# EAGLE design tangnano9k-bob-adapter2 (EAGLE 9.0.1)
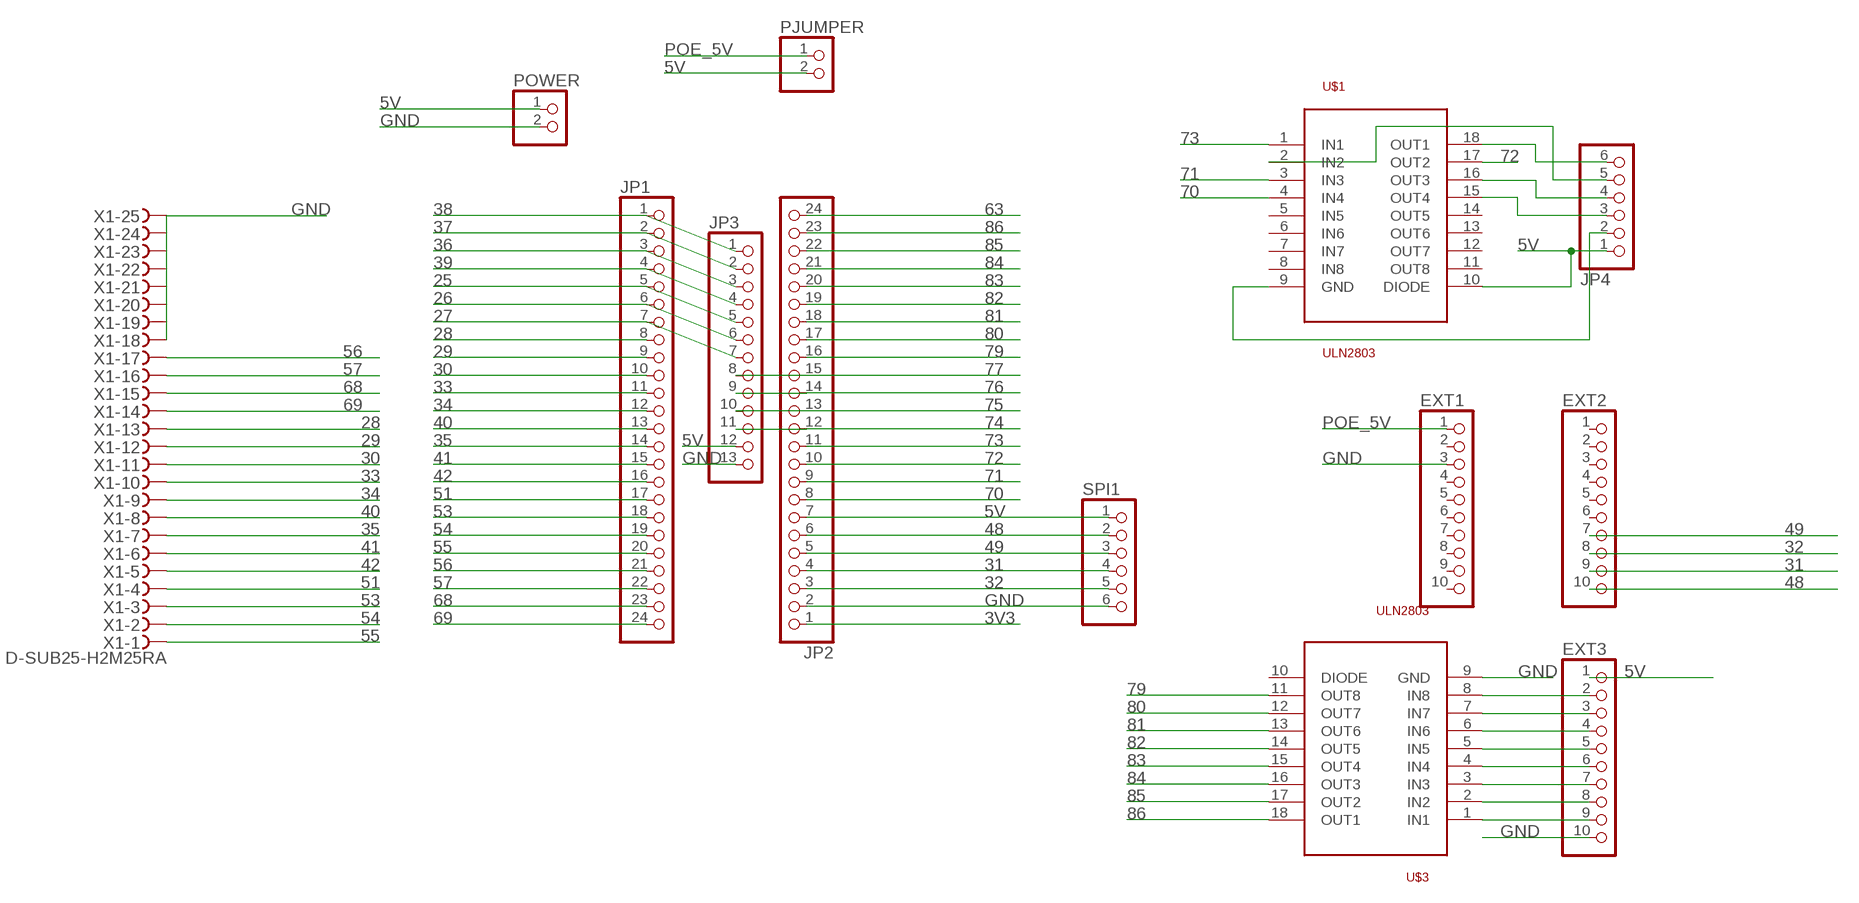
[diagram p0: schematic, sheet 1]

## Parts
EXT1  PINHD-1X10  [1X10]
EXT2  PINHD-1X10  [1X10]
EXT3  PINHD-1X10  [1X10]
JP1  PINHD-1X24  [1X24]
JP2  PINHD-1X24  [1X24]
JP3  PINHD-1X13  [1X13]
JP4  PINHD-1X6/90  [1X06/90]
PJUMPER  PINHD-1X2  [1X02]
POWER  PINHD-1X2  [1X02]
SPI1  PINHD-1X6  [1X06]
U$1  ULN2803  [SO18L]
U$3  ULN2803  [SO18L]
X1  D-SUB25-H2M25RA  [H2M25RA]

## Nets
3V3: JP2.1
5V: EXT3.1 JP2.7 JP3.12 JP4.1 PJUMPER.2 POWER.1 SPI1.1 U$1.10(DIODE)
25: JP1.5 JP3.5
26: JP1.6 JP3.6
27: JP1.7 JP3.7
28: JP1.8 X1.13
29: JP1.9 X1.12
30: JP1.10 X1.11
31: EXT2.9 JP2.4 SPI1.4
32: EXT2.8 JP2.3 SPI1.5
33: JP1.11 X1.10
34: JP1.12 X1.9
35: JP1.14 X1.7
36: JP1.3 JP3.3
37: JP1.2 JP3.2
38: JP1.1 JP3.1
39: JP1.4 JP3.4
40: JP1.13 X1.8
41: JP1.15 X1.6
42: JP1.16 X1.5
48: EXT2.10 JP2.6 SPI1.2
49: EXT2.7 JP2.5 SPI1.3
51: JP1.17 X1.4
53: JP1.18 X1.3
54: JP1.19 X1.2
55: JP1.20 X1.1
56: JP1.21 X1.17
57: JP1.22 X1.16
63: JP2.24
68: JP1.23 X1.15
69: JP1.24 X1.14
70: JP2.8 U$1.4(IN4)
71: JP2.9 U$1.3(IN3)
72: JP2.10 U$1.17(OUT2)
73: JP2.11 U$1.1(IN1)
74: JP2.12 JP3.11
75: JP2.13 JP3.10
76: JP2.14 JP3.9
77: JP2.15 JP3.8
79: JP2.16 U$3.11(OUT8)
80: JP2.17 U$3.12(OUT7)
81: JP2.18 U$3.13(OUT6)
82: JP2.19 U$3.14(OUT5)
83: JP2.20 U$3.15(OUT4)
84: JP2.21 U$3.16(OUT3)
85: JP2.22 U$3.17(OUT2)
86: JP2.23 U$3.18(OUT1)
GND: EXT1.3 EXT3.10 JP2.2 JP3.13 JP4.2 POWER.2 SPI1.6 U$1.9(GND) U$3.9(GND) X1.18 X1.19 X1.20 X1.21 X1.22 X1.23 X1.24 X1.25
N$1: EXT3.9 U$3.1(IN1)
N$2: JP4.6 U$1.18(OUT1)
N$3: JP4.5 U$1.2(IN2)
N$4: JP4.4 U$1.16(OUT3)
N$5: JP4.3 U$1.15(OUT4)
N$6: EXT3.8 U$3.2(IN2)
N$7: EXT3.7 U$3.3(IN3)
N$8: EXT3.6 U$3.4(IN4)
N$9: EXT3.5 U$3.5(IN5)
N$10: EXT3.4 U$3.6(IN6)
N$11: EXT3.3 U$3.7(IN7)
N$12: EXT3.2 U$3.8(IN8)
POE_5V: EXT1.1 PJUMPER.1
Unconnected: EXT1.2 EXT1.4 EXT1.5 EXT1.6 EXT1.7 EXT1.8 EXT1.9 EXT1.10 EXT2.1 EXT2.2 EXT2.3 EXT2.4 EXT2.5 EXT2.6 U$1.5(IN5) U$1.6(IN6) U$1.7(IN7) U$1.8(IN8) U$1.11(OUT8) U$1.12(OUT7) U$1.13(OUT6) U$1.14(OUT5) U$3.10(DIODE)

## Library data of the parts
EXT1-EXT3 = pinhead:PINHD-1X10: PIN HEADER
JP1 JP2 = pinhead:PINHD-1X24: PIN HEADER
JP3 = pinhead:PINHD-1X13: PIN HEADER
JP4 SPI1 = pinhead:PINHD-1X6: PIN HEADER
PJUMPER POWER = pinhead:PINHD-1X2: PIN HEADER
U$1 U$3 = uln2803:ULN2803
X1 = con-thomas-betts:D-SUB25-: D-Subminiatur Connector Source: Electronioc Interconnects European Edition 1998; OC_FARNELL: unknown; OC_NEWARK: unknown

## Board
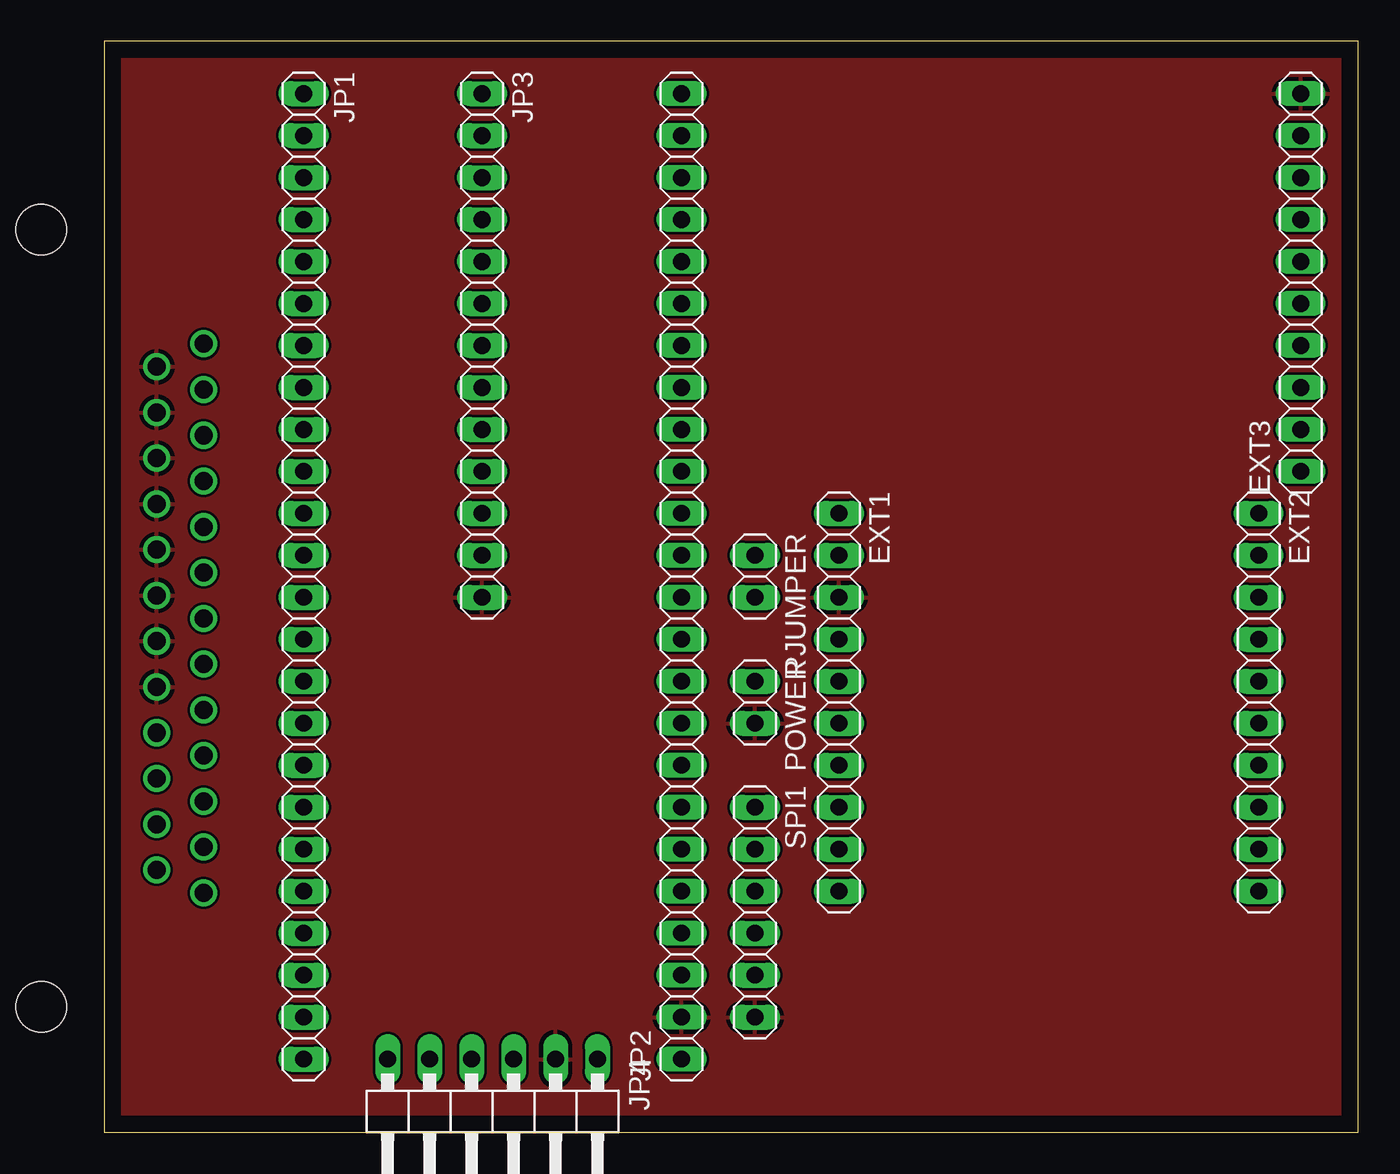
[diagram p1: board, top side]
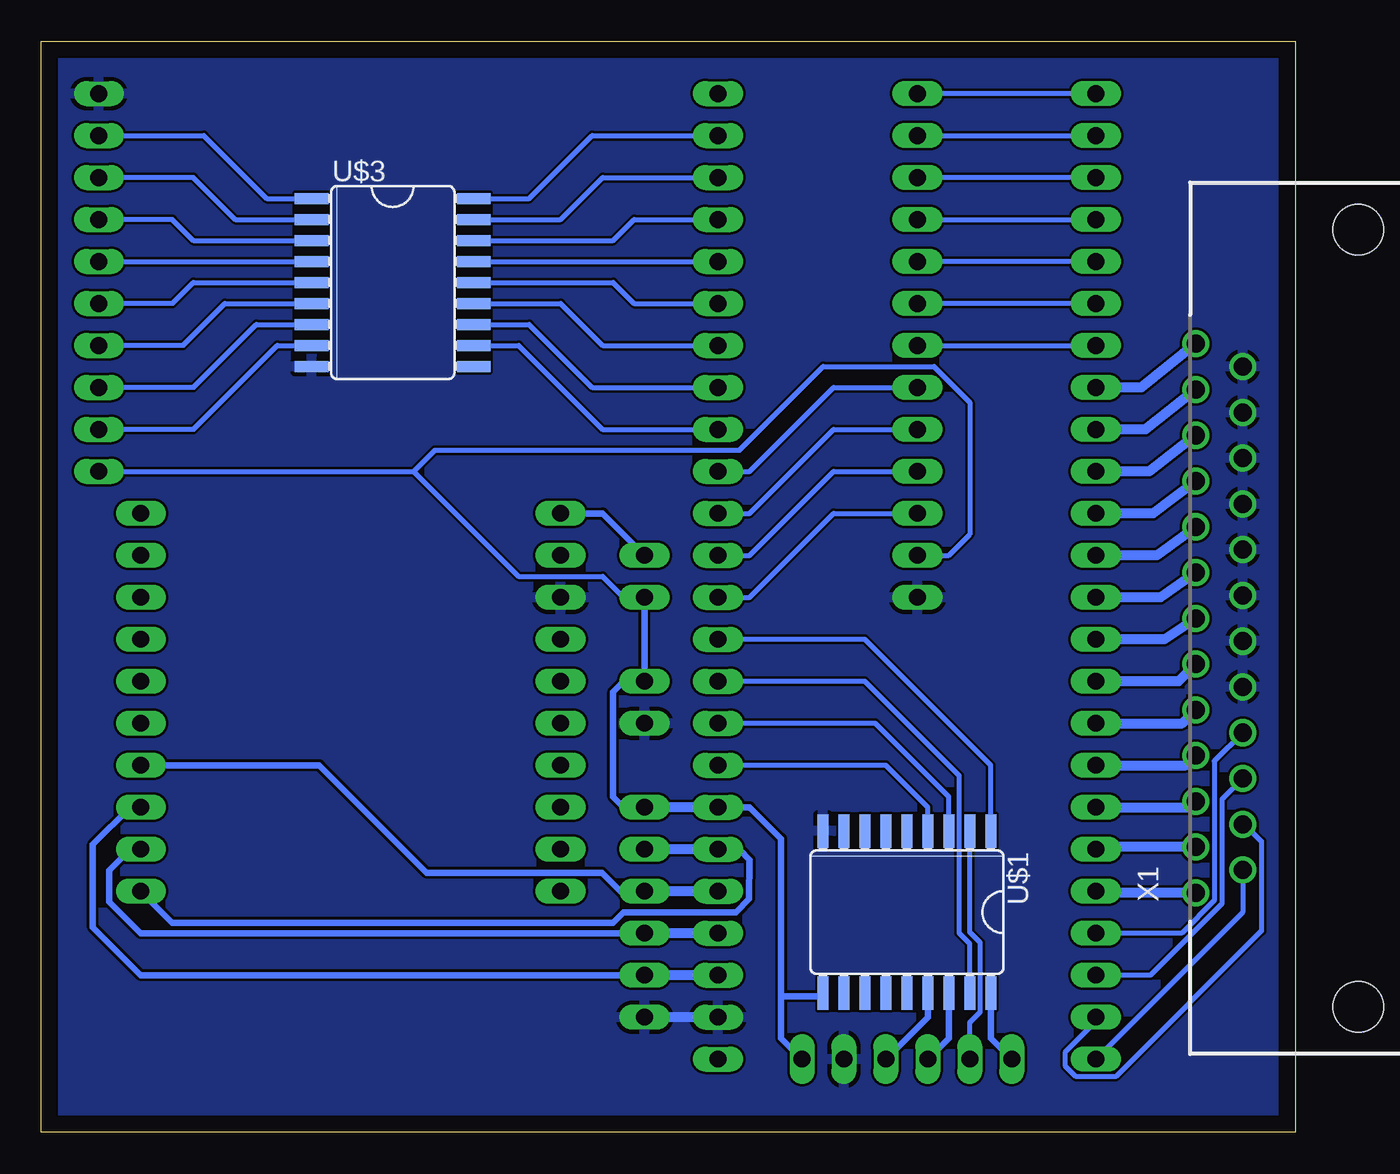
[diagram p2: board, bottom side, seen from below]

Size 75.87 x 66.03 mm. Coordinates in mm from the lower left corner, seen from the top.
Outline: 0,0 75.87,0 75.87,66.03 0,66.03 0,0
Copper layers (1*16): Top 0.035mm / dielectric 1.5mm / Bottom 0.035mm
Design rules "default": minimum track width 6mil, minimum drill 0.35mm, track to track 6mil, track to pad 6mil, pad to pad 6mil, via to via 6mil, smd to smd 6mil, copper to edge 40mil, drill to drill 6mil, minimum pad ring 10mil, minimum via ring 8mil, stop-mask expansion 4mil, vias tented up to drill 0mil, thermal gap 10mil

### Footprints (pad centres in the part's own frame; a part is rotated, then mirrored left to right if it is on the bottom)
1X10 = drill 1.016 long: 1 -11.43,0; 2 -8.89,0; 3 -6.35,0; 4 -3.81,0; 5 -1.27,0; 6 1.27,0; 7 3.81,0; 8 6.35,0; 9 8.89,0; 10 11.43,0
1X24 = drill 1.016 long: 1 -29.21,0; 2 -26.67,0; 3 -24.13,0; 4 -21.59,0; 5 -19.05,0; 6 -16.51,0; 7 -13.97,0; 8 -11.43,0; 9 -8.89,0; 10 -6.35,0; 11 -3.81,0; 12 -1.27,0; 13 1.27,0; 14 3.81,0; 15 6.35,0; 16 8.89,0; 17 11.43,0; 18 13.97,0; 19 16.51,0; 20 19.05,0; 21 21.59,0; 22 24.13,0; 23 26.67,0; 24 29.21,0
1X13 = drill 1.016 long: 1 -15.24,0; 2 -12.7,0; 3 -10.16,0; 4 -7.62,0; 5 -5.08,0; 6 -2.54,0; 7 0,0; 8 2.54,0; 9 5.08,0; 10 7.62,0; 11 10.16,0; 12 12.7,0; 13 15.24,0
1X06/90 = drill 1.016 long: 1 -6.35,-3.81; 2 -3.81,-3.81; 3 -1.27,-3.81; 4 1.27,-3.81; 5 3.81,-3.81; 6 6.35,-3.81
1X02 = drill 1.016 long: 1 -1.27,0; 2 1.27,0
1X06 = drill 1.016 long: 1 -6.35,0; 2 -3.81,0; 3 -1.27,0; 4 1.27,0; 5 3.81,0; 6 6.35,0
SO18L = smd 0.66 x 2.032: 1 -5.08,-4.902; 2 -3.81,-4.902; 3 -2.54,-4.902; 4 -1.27,-4.902; 5 0,-4.902; 6 1.27,-4.902; 7 2.54,-4.902; 8 3.81,-4.902; 9 5.08,-4.902; 10 5.08,4.902; 11 3.81,4.902; 12 2.54,4.902; 13 1.27,4.902; 14 0,4.902; 15 -1.27,4.902; 16 -2.54,4.902; 17 -3.81,4.902; 18 -5.08,4.902
H2M25RA = drill 1.092: 1 -16.612,7.925; 2 -13.843,7.925; 3 -11.074,7.925; 4 -8.306,7.925; 5 -5.537,7.925; 6 -2.769,7.925; 7 0,7.925; 8 2.769,7.925; 9 5.537,7.925; 10 8.306,7.925; 11 11.074,7.925; 12 13.843,7.925; 13 16.612,7.925; 14 -15.227,5.08; 15 -12.459,5.08; 16 -9.69,5.08; 17 -6.921,5.08; 18 -4.153,5.08; 19 -1.384,5.08; 20 1.384,5.08; 21 4.153,5.08; 22 6.921,5.08; 23 9.69,5.08; 24 12.459,5.08; 25 15.227,5.08 | hole 3.048: -23.52,-1.905; 23.52,-1.905

### Placement (x,y rotation side)
EXT1  44.45,26.04 270 top
EXT2  69.85,26.04 270 top
EXT3  72.39,51.44 90 top
JP1  12.06,33.66 270 top
JP2  34.92,33.66 90 top
JP3  22.86,47.62 270 top
JP4  23.49,0.64 180 top
PJUMPER  39.37,33.66 270 top
POWER  39.37,26.04 270 top
SPI1  39.37,13.33 270 top
U$1  23.49,13.33 180 bottom
U$3  54.61,51.44 270 bottom
X1  -1.91,31.12 90 bottom

### Tracks (layer width: path | path; a pad name or v marks a point on that pad's centre or on a via)
5V
  Bottom 0.305: PJUMPER.2 40.64,32.38 41.91,33.66 46.99,33.66 53.34,40.01 | EXT3.1 53.34,40.01 | JP3.12 20.95,34.93 19.69,36.2 19.69,44.18 21.86,46.36 28.57,46.36 33.65,41.27 52.07,41.27 53.34,40.01
  Bottom 0.406: SPI1.1 40.64,19.69 41.27,20.32 41.27,26.67 40.64,27.3 POWER.1 PJUMPER.2 | 31.11,8.25 31.11,17.78 33.02,19.69 JP2.7 | 31.11,8.25 31.11,5.71 JP4.1 | U$1.10 28.75,8.25 31.11,8.25
  Bottom 0.61: JP2.7 SPI1.1
25
  Bottom 0.305: JP1.5 JP3.5
26
  Bottom 0.305: JP1.6 JP3.6
27
  Bottom 0.305: JP3.7 JP1.7
28
  Bottom 0.61: X1.13 9.3,45.09 JP1.8
29
  Bottom 0.61: X1.12 9.07,42.55 JP1.9
30
  Bottom 0.61: X1.11 8.84,40.01 JP1.10
31
  Bottom 0.406: SPI1.4 69.85,12.06 71.76,13.97 71.76,15.88 70.48,17.14 EXT2.9
  Bottom 0.61: JP2.4 SPI1.4
32
  Bottom 0.406: SPI1.5 69.85,9.53 72.75,12.42 72.75,17.42 70.48,19.69 EXT2.8
  Bottom 0.61: JP2.3 SPI1.5
33
  Bottom 0.61: X1.10 8.61,37.47 JP1.11
34
  Bottom 0.61: X1.9 8.38,34.93 JP1.12
35
  Bottom 0.61: X1.7 7.92,29.85 JP1.14
36
  Bottom 0.305: JP1.3 JP3.3
37
  Bottom 0.305: JP3.2 JP1.2
38
  Bottom 0.305: JP1.1 JP3.1
39
  Bottom 0.305: JP3.4 JP1.4
40
  Bottom 0.61: X1.8 8.15,32.38 JP1.13
41
  Bottom 0.61: X1.6 7.06,27.3 JP1.15
42
  Bottom 0.61: JP1.16 6.83,24.77 X1.5
48
  Bottom 0.406: JP2.6 34.29,17.14 34.31,17.12 33.63,17.12 33.02,16.51 33.04,14.14 33.85,13.33 40.64,13.33 41.27,12.7 67.95,12.7 EXT2.10
  Bottom 0.61: JP2.6 SPI1.2
49
  Bottom 0.406: SPI1.3 40.84,14.6 41.95,15.72 52.55,15.72 59.05,22.23 EXT2.7
  Bottom 0.61: JP2.5 SPI1.3
51
  Bottom 0.61: JP1.17 6.6,22.23 X1.4
53
  Bottom 0.61: JP1.18 6.38,19.69 X1.3
54
  Bottom 0.61: X1.2 10.67,17.27 JP1.19
55
  Bottom 0.61: X1.1 10.69,14.5 JP1.20
56
  Bottom 0.305: X1.17 4.9,22.47 4.9,14.04 6.87,12.06 JP1.21
57
  Bottom 0.305: X1.16 4.44,20.16 4.44,13.85 8.76,9.53 JP1.22
68
  Bottom 0.305: X1.15 3.17,18.75 2.05,17.62 2.05,12.19 10.86,3.38 13.27,3.38 13.89,4 13.89,4.89 12.06,6.72 JP1.23
69
  Bottom 0.305: X1.14 3.17,13.33 JP1.24
70
  Bottom 0.305: U$1.4 22.23,19.69 24.77,22.23 JP2.8
71
  Bottom 0.305: U$1.3 20.95,20.32 25.4,24.77 JP2.9
72
  Bottom 0.305: U$1.17 19.69,11.43 20.32,12.06 20.32,21.59 26.03,27.3 JP2.10
73
  Bottom 0.305: U$1.1 18.41,22.23 26.03,29.85 JP2.11
74
  Bottom 0.305: JP2.12 33.02,32.38 27.94,37.47 JP3.11
75
  Bottom 0.305: JP2.13 33.02,34.93 27.94,40.01 JP3.10
76
  Bottom 0.305: JP2.14 33.02,37.47 27.94,42.55 JP3.9
77
  Bottom 0.305: JP2.15 33.02,40.01 27.94,45.09 JP3.8
79
  Bottom 0.305: JP2.16 41.91,42.55 46.99,47.62 U$3.11
80
  Bottom 0.305: U$3.12 46.35,48.9 42.54,45.09 JP2.17
81
  Bottom 0.305: U$3.13 44.45,50.16 41.91,47.62 JP2.18
82
  Bottom 0.305: U$3.14 41.27,51.44 40,50.16 JP2.19
83
  Bottom 0.305: U$3.15 JP2.20
84
  Bottom 0.305: JP2.21 40,55.25 41.27,53.98 U$3.16
85
  Bottom 0.305: U$3.17 44.45,55.25 41.91,57.79 JP2.22
86
  Bottom 0.305: U$3.18 46.35,56.52 42.54,60.33 JP2.23
GND
  Bottom 0.61: JP2.2 SPI1.6
  pour Bottom: -15.88,67.95 -15.88,-4.44 80.01,-4.44 80.01,67.95
  pour Top: -6.35,71.75 83.19,71.75 83.19,-1.91 -6.35,-1.91
N$1
  Bottom 0.305: U$3.1 62.23,56.52 66.04,60.33 EXT3.9
N$2
  Bottom 0.406: JP4.6 18.41,5.71 U$1.18
N$3
  Bottom 0.305: JP4.5 19.69,6.66 19.05,7.29 19.05,11.48 19.69,12.12 U$1.2
N$4
  Bottom 0.406: JP4.4 20.95,5.71 U$1.16
N$5
  Bottom 0.406: JP4.3 22.23,6.99 U$1.15
N$6
  Bottom 0.305: EXT3.8 66.68,57.79 64.14,55.25 U$3.2
N$7
  Bottom 0.305: EXT3.7 67.95,55.25 66.68,53.98 U$3.3
N$8
  Bottom 0.305: EXT3.6 U$3.4
N$9
  Bottom 0.305: EXT3.5 67.95,50.16 66.68,51.44 U$3.5
N$10
  Bottom 0.305: EXT3.4 67.31,47.62 64.77,50.16 U$3.6
N$11
  Bottom 0.305: EXT3.3 66.68,45.09 62.87,48.9 U$3.7
N$12
  Bottom 0.305: EXT3.2 66.68,42.55 61.59,47.62 U$3.8
POE_5V
  Bottom 0.406: EXT1.1 41.91,37.47 PJUMPER.1